# Altium schematic sheet micro.SchDoc
size A4; Organization: Altium Limited; Address1: L3, 12a Rodborough Rd; Address2: Frenchs Forest; Address3: NSW; Address4: Australia 2086
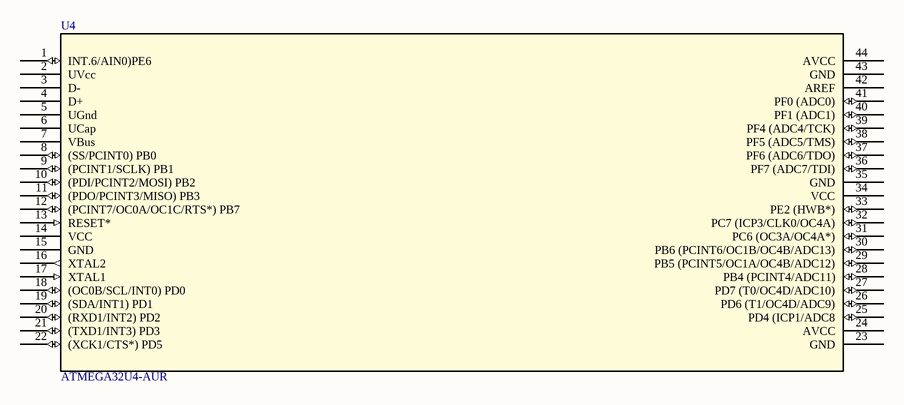
[diagram p0: micro.SchDoc]

## Parts
U4  ATMEGA32U4-AUR  [44ML]

## Nets

Not connected (* = marked no-connect by the designer): U4 1(INT.6/AIN0)PE6) 2(UVcc) 3(D-) 4(D+) 5(UGnd) 6(UCap) 7(VBus) 8((SS/PCINT0)_PB0) 9((PCINT1/SCLK)_PB1) 10((PDI/PCINT2/MOSI)_PB2) 11((PDO/PCINT3/MISO)_PB3) 12((PCINT7/OC0A/OC1C/RTS*)_PB7) 13(RESET*) 14(VCC) 15(GND) 16(XTAL2) 17(XTAL1) 18((OC0B/SCL/INT0)_PD0) 19((SDA/INT1)_PD1) 20((RXD1/INT2)_PD2) 21((TXD1/INT3)_PD3) 22((XCK1/CTS*)_PD5) 23(GND) 24(AVCC) 25(PD4_(ICP1/ADC8) 26(PD6_(T1/OC4D/ADC9)) 27(PD7_(T0/OC4D/ADC10)) 28(PB4_(PCINT4/ADC11)) 29(PB5_(PCINT5/OC1A/OC4B/ADC12)) 30(PB6_(PCINT6/OC1B/OC4B/ADC13)) 31(PC6_(OC3A/OC4A*)) 32(PC7_(ICP3/CLK0/OC4A)) 33(PE2_(HWB*)) 34(VCC) 35(GND) 36(PF7_(ADC7/TDI)) 37(PF6_(ADC6/TDO)) 38(PF5_(ADC5/TMS)) 39(PF4_(ADC4/TCK)) 40(PF1_(ADC1)) 41(PF0_(ADC0)) 42(AREF) 43(GND) 44(AVCC)

## Notes on the sheet
- Title
- Size:
- Date:
- A4
- Number:
- Time:
- Revision:
- Sheet
- of
- File:

## Library data of the parts
U4 = ATMEGA32U4-AUR: Imported; Vendor: Atmel; Built_By: EMA_UL_Team; C: Copyright (C) 2015 Accelerated Designs. All rights reserved; Manufacturer_Part_Number: ATMEGA32U4-AUR; RefDes: RefDes; Type: DEV; Value: Value